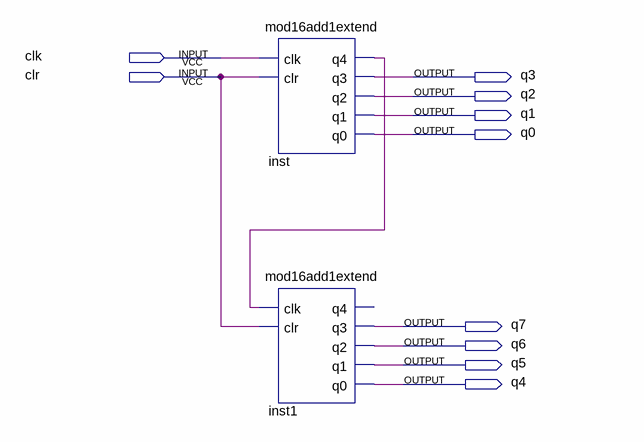
[diagram p0: schematic sheet]
// Quartus schematic mod256add1.bdf as structural Verilog: 2 symbols, 10 pins
module mod256add1 (
  input  clk,
  input  clr,
  output q3,
  output q2,
  output q1,
  output q0,
  output q7,
  output q6,
  output q5,
  output q4
);

  wire inst_q4;

  mod16add1extend inst (.clk(clk), .clr(clr), .q4(inst_q4), .q3(q3), .q2(q2), .q1(q1), .q0(q0));
  mod16add1extend inst1 (.clk(inst_q4), .clr(clr), .q3(q7), .q2(q6), .q1(q5), .q0(q4));  // open: q4
endmodule
